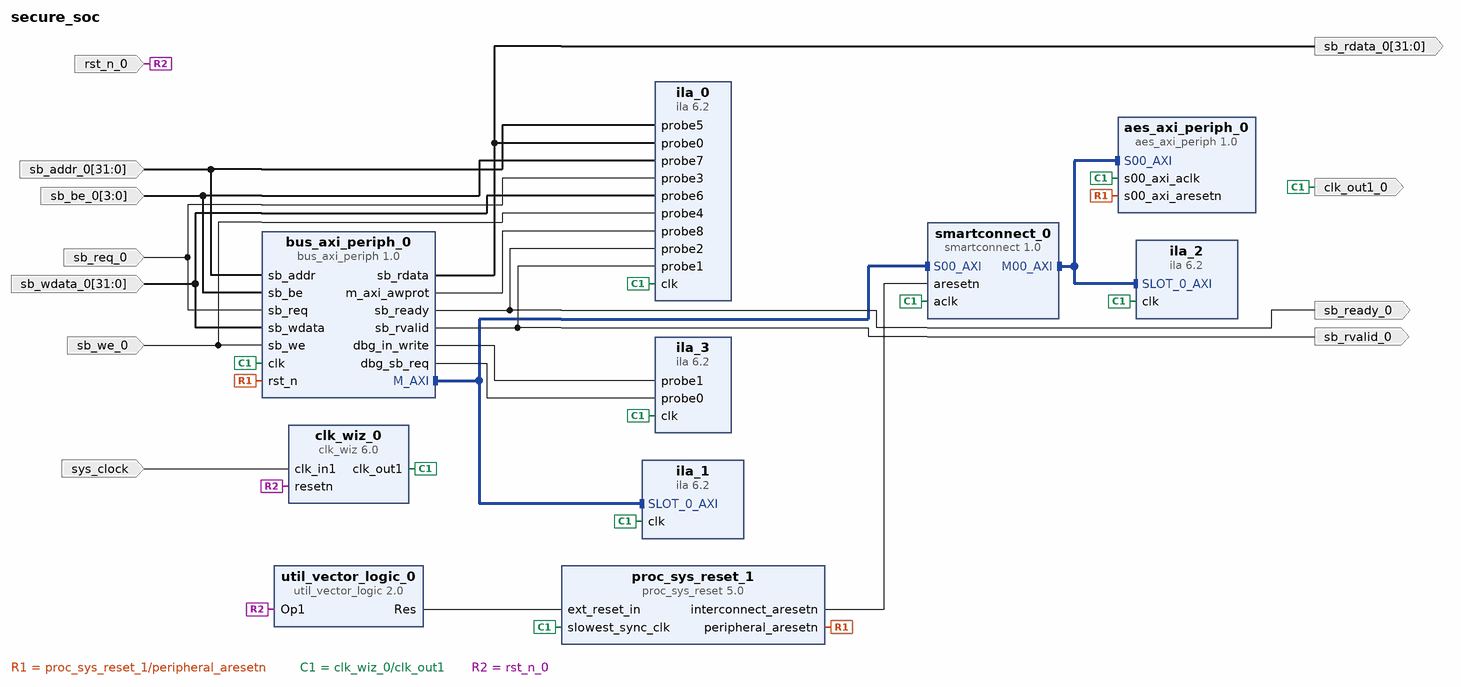
[diagram p0: block diagram of the top level]
# Vivado block design secure_soc, xc7z020clg400-1, Vivado 2025.1
create_bd_design secure_soc

create_bd_port -dir I -type clk sys_clock
set_property -dict {CONFIG.ASSOCIATED_RESET rst_n_0 CONFIG.FREQ_HZ 125000000 CONFIG.PHASE 0.0} [get_bd_ports sys_clock]
create_bd_port -dir O sb_ready_0
create_bd_port -dir O sb_rvalid_0
create_bd_port -dir I sb_req_0
create_bd_port -dir I sb_we_0
create_bd_port -dir O -from 31 -to 0 sb_rdata_0
create_bd_port -dir I -from 31 -to 0 sb_addr_0
create_bd_port -dir I -from 31 -to 0 sb_wdata_0
create_bd_port -dir I -from 3 -to 0 sb_be_0
create_bd_port -dir I -type rst rst_n_0
set_property -dict {CONFIG.POLARITY ACTIVE_LOW} [get_bd_ports rst_n_0]
create_bd_port -dir O -type clk clk_out1_0

create_bd_cell -type ip -vlnv user.org:user:aes_axi_periph:1.0 aes_axi_periph_0
create_bd_cell -type ip -vlnv xilinx.com:ip:smartconnect:1.0 smartconnect_0
set_property -dict {CONFIG.NUM_SI 1} [get_bd_cells smartconnect_0]
create_bd_cell -type ip -vlnv user.org:user:bus_axi_periph:1.0 bus_axi_periph_0
create_bd_cell -type ip -vlnv xilinx.com:ip:clk_wiz:6.0 clk_wiz_0
set_property -dict [list \
  CONFIG.CLKIN1_JITTER_PS 80.0 \
  CONFIG.CLKOUT1_DRIVES BUFG \
  CONFIG.CLKOUT1_JITTER 288.707 \
  CONFIG.CLKOUT1_PHASE_ERROR 258.220 \
  CONFIG.CLKOUT1_REQUESTED_OUT_FREQ 50.000 \
  CONFIG.CLKOUT2_DRIVES BUFG \
  CONFIG.CLKOUT3_DRIVES BUFG \
  CONFIG.CLKOUT4_DRIVES BUFG \
  CONFIG.CLKOUT5_DRIVES BUFG \
  CONFIG.CLKOUT6_DRIVES BUFG \
  CONFIG.CLKOUT7_DRIVES BUFG \
  CONFIG.FEEDBACK_SOURCE FDBK_AUTO \
  CONFIG.MMCM_BANDWIDTH OPTIMIZED \
  CONFIG.MMCM_CLKFBOUT_MULT_F 34 \
  CONFIG.MMCM_CLKIN1_PERIOD 8.000 \
  CONFIG.MMCM_CLKIN2_PERIOD 10.0 \
  CONFIG.MMCM_CLKOUT0_DIVIDE_F 17 \
  CONFIG.MMCM_COMPENSATION ZHOLD \
  CONFIG.MMCM_DIVCLK_DIVIDE 5 \
  CONFIG.PLL_CLKIN_PERIOD 8.000 \
  CONFIG.PRIMITIVE PLL \
  CONFIG.PRIM_IN_FREQ 125.000 \
  CONFIG.RESET_PORT resetn \
  CONFIG.RESET_TYPE ACTIVE_LOW \
  CONFIG.USE_LOCKED false \
] [get_bd_cells clk_wiz_0]
create_bd_cell -type ip -vlnv xilinx.com:ip:ila:6.2 ila_0
set_property -dict {CONFIG.C_MONITOR_TYPE Native CONFIG.C_NUM_OF_PROBES 9} [get_bd_cells ila_0]
create_bd_cell -type ip -vlnv xilinx.com:ip:ila:6.2 ila_1
set_property -dict {CONFIG.C_ADV_TRIGGER false} [get_bd_cells ila_1]
create_bd_cell -type ip -vlnv xilinx.com:ip:ila:6.2 ila_2
create_bd_cell -type ip -vlnv xilinx.com:ip:ila:6.2 ila_3
set_property -dict {CONFIG.C_MONITOR_TYPE Native CONFIG.C_NUM_OF_PROBES 2} [get_bd_cells ila_3]
create_bd_cell -type ip -vlnv xilinx.com:ip:util_vector_logic:2.0 util_vector_logic_0
set_property -dict {CONFIG.C_OPERATION not} [get_bd_cells util_vector_logic_0]
create_bd_cell -type ip -vlnv xilinx.com:ip:proc_sys_reset:5.0 proc_sys_reset_1

# ---- connections ----

connect_bd_intf_net -intf_net bus_axi_periph_0_M_AXI [get_bd_intf_pins bus_axi_periph_0/M_AXI] [get_bd_intf_pins smartconnect_0/S00_AXI]
connect_bd_intf_net [get_bd_intf_pins bus_axi_periph_0/M_AXI] [get_bd_intf_pins ila_1/SLOT_0_AXI]
connect_bd_intf_net -intf_net smartconnect_0_M00_AXI [get_bd_intf_pins aes_axi_periph_0/S00_AXI] [get_bd_intf_pins smartconnect_0/M00_AXI]
connect_bd_intf_net [get_bd_intf_pins aes_axi_periph_0/S00_AXI] [get_bd_intf_pins ila_2/SLOT_0_AXI]
connect_bd_net [get_bd_pins proc_sys_reset_1/peripheral_aresetn] [get_bd_pins bus_axi_periph_0/rst_n] [get_bd_pins aes_axi_periph_0/s00_axi_aresetn]
connect_bd_net -net bus_axi_periph_0_dbg_in_write [get_bd_pins bus_axi_periph_0/dbg_in_write] [get_bd_pins ila_3/probe1]
connect_bd_net -net bus_axi_periph_0_dbg_sb_req [get_bd_pins bus_axi_periph_0/dbg_sb_req] [get_bd_pins ila_3/probe0]
connect_bd_net -net bus_axi_periph_0_m_axi_awprot [get_bd_pins bus_axi_periph_0/m_axi_awprot] [get_bd_pins ila_0/probe8]
connect_bd_net -net bus_axi_periph_0_sb_rdata [get_bd_pins bus_axi_periph_0/sb_rdata] [get_bd_ports sb_rdata_0] [get_bd_pins ila_0/probe0]
connect_bd_net -net bus_axi_periph_0_sb_ready [get_bd_pins bus_axi_periph_0/sb_ready] [get_bd_ports sb_ready_0] [get_bd_pins ila_0/probe2]
connect_bd_net -net bus_axi_periph_0_sb_rvalid [get_bd_pins bus_axi_periph_0/sb_rvalid] [get_bd_ports sb_rvalid_0] [get_bd_pins ila_0/probe1]
connect_bd_net [get_bd_pins clk_wiz_0/clk_out1] \
  [get_bd_ports clk_out1_0] [get_bd_pins smartconnect_0/aclk] [get_bd_pins ila_0/clk] [get_bd_pins ila_1/clk] \
  [get_bd_pins ila_2/clk] [get_bd_pins ila_3/clk] [get_bd_pins proc_sys_reset_1/slowest_sync_clk] \
  [get_bd_pins bus_axi_periph_0/clk] [get_bd_pins aes_axi_periph_0/s00_axi_aclk]
connect_bd_net [get_bd_pins proc_sys_reset_1/interconnect_aresetn] [get_bd_pins smartconnect_0/aresetn]
connect_bd_net -net rst_n_0_1 [get_bd_ports rst_n_0] [get_bd_pins clk_wiz_0/resetn] [get_bd_pins util_vector_logic_0/Op1]
connect_bd_net -net sb_addr_0_1 [get_bd_ports sb_addr_0] [get_bd_pins ila_0/probe5] [get_bd_pins bus_axi_periph_0/sb_addr]
connect_bd_net -net sb_be_0_1 [get_bd_ports sb_be_0] [get_bd_pins ila_0/probe7] [get_bd_pins bus_axi_periph_0/sb_be]
connect_bd_net -net sb_req_0_1 [get_bd_ports sb_req_0] [get_bd_pins ila_0/probe3] [get_bd_pins bus_axi_periph_0/sb_req]
connect_bd_net -net sb_wdata_0_1 [get_bd_ports sb_wdata_0] [get_bd_pins ila_0/probe6] [get_bd_pins bus_axi_periph_0/sb_wdata]
connect_bd_net -net sb_we_0_1 [get_bd_ports sb_we_0] [get_bd_pins ila_0/probe4] [get_bd_pins bus_axi_periph_0/sb_we]
connect_bd_net [get_bd_ports sys_clock] [get_bd_pins clk_wiz_0/clk_in1]
connect_bd_net [get_bd_pins util_vector_logic_0/Res] [get_bd_pins proc_sys_reset_1/ext_reset_in]
set_property HDL_ATTRIBUTE.DEBUG true [get_bd_intf_nets bus_axi_periph_0_M_AXI]
set_property HDL_ATTRIBUTE.MARK_DEBUG true [get_bd_intf_nets bus_axi_periph_0_M_AXI]
set_property HDL_ATTRIBUTE.DEBUG true [get_bd_intf_nets smartconnect_0_M00_AXI]
set_property HDL_ATTRIBUTE.MARK_DEBUG true [get_bd_intf_nets smartconnect_0_M00_AXI]
set_property HDL_ATTRIBUTE.DEBUG true [get_bd_nets bus_axi_periph_0_dbg_in_write]
set_property HDL_ATTRIBUTE.MARK_DEBUG true [get_bd_nets bus_axi_periph_0_dbg_in_write]
set_property HDL_ATTRIBUTE.DEBUG true [get_bd_nets bus_axi_periph_0_dbg_sb_req]
set_property HDL_ATTRIBUTE.MARK_DEBUG true [get_bd_nets bus_axi_periph_0_dbg_sb_req]
set_property HDL_ATTRIBUTE.DEBUG true [get_bd_nets bus_axi_periph_0_m_axi_awprot]
set_property HDL_ATTRIBUTE.MARK_DEBUG true [get_bd_nets bus_axi_periph_0_m_axi_awprot]
set_property HDL_ATTRIBUTE.DEBUG true [get_bd_nets bus_axi_periph_0_sb_rdata]
set_property HDL_ATTRIBUTE.MARK_DEBUG true [get_bd_nets bus_axi_periph_0_sb_rdata]
set_property HDL_ATTRIBUTE.DEBUG true [get_bd_nets bus_axi_periph_0_sb_ready]
set_property HDL_ATTRIBUTE.MARK_DEBUG true [get_bd_nets bus_axi_periph_0_sb_ready]
set_property HDL_ATTRIBUTE.DEBUG true [get_bd_nets bus_axi_periph_0_sb_rvalid]
set_property HDL_ATTRIBUTE.MARK_DEBUG true [get_bd_nets bus_axi_periph_0_sb_rvalid]
set_property HDL_ATTRIBUTE.DEBUG true [get_bd_nets sb_addr_0_1]
set_property HDL_ATTRIBUTE.MARK_DEBUG true [get_bd_nets sb_addr_0_1]
set_property HDL_ATTRIBUTE.DEBUG true [get_bd_nets sb_be_0_1]
set_property HDL_ATTRIBUTE.MARK_DEBUG true [get_bd_nets sb_be_0_1]
set_property HDL_ATTRIBUTE.DEBUG true [get_bd_nets sb_req_0_1]
set_property HDL_ATTRIBUTE.MARK_DEBUG true [get_bd_nets sb_req_0_1]
set_property HDL_ATTRIBUTE.DEBUG true [get_bd_nets sb_wdata_0_1]
set_property HDL_ATTRIBUTE.MARK_DEBUG true [get_bd_nets sb_wdata_0_1]
set_property HDL_ATTRIBUTE.DEBUG true [get_bd_nets sb_we_0_1]
set_property HDL_ATTRIBUTE.MARK_DEBUG true [get_bd_nets sb_we_0_1]

# ---- address map ----
assign_bd_address -offset 0x00090000 -range 64K -target_address_space [get_bd_addr_spaces bus_axi_periph_0/m_axi] [get_bd_addr_segs aes_axi_periph_0/S00_AXI/S00_AXI_reg]

validate_bd_design
save_bd_design
